# Altium project USB_HUB.PrjPcb
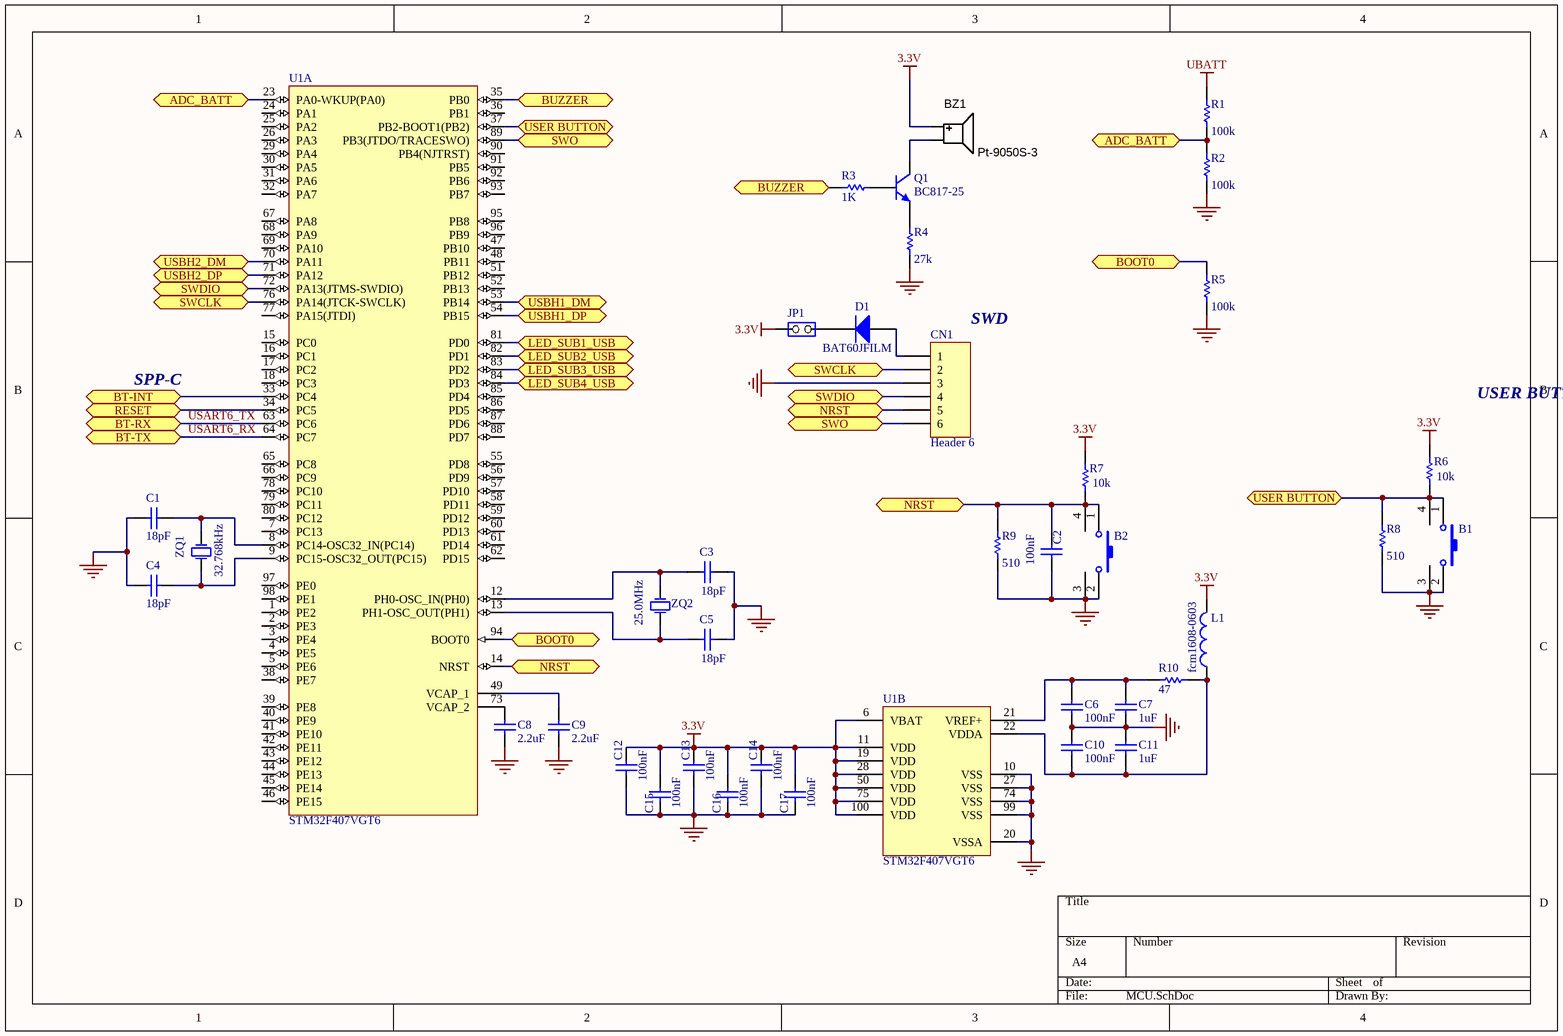
[diagram p0: MCU.SchDoc]
3 sheets, 96 parts. Net scope: flat (ports and power ports of the same name join across sheets).
Sheets:
  MCU.SchDoc
  HUB.SchDoc
  Bluetooth.SchDoc

## Sheet MCU.SchDoc
size A4

### Parts
B1  SW-PB  [SPST-2]  (value not drawn)
B2  SW-PB  [SPST-2]  (value not drawn)
BZ1  Pt-9050S-3  [BUZZER_12.0X8.5MM]
C1  value 18pF  [RAD-0.3]  (hidden comment: Cap)
C2  value 100nF  [RAD-0.3]  (hidden comment: Cap)
C3  value 18pF  [RAD-0.3]  (hidden comment: Cap)
C4  value 18pF  [RAD-0.3]  (hidden comment: Cap)
C5  value 18pF  [RAD-0.3]  (hidden comment: Cap)
C6  value 100nF  [RAD-0.3]  (hidden comment: Cap)
C7  value 1uF  [RAD-0.3]  (hidden comment: Cap)
C8  value 2.2uF  [RAD-0.3]  (hidden comment: Cap)
C9  value 2.2uF  [RAD-0.3]  (hidden comment: Cap)
C10  value 100nF  [RAD-0.3]  (hidden comment: Cap)
C11  value 1uF  [RAD-0.3]  (hidden comment: Cap)
C12  value 100nF  [RAD-0.3]  (hidden comment: Cap)
C13  value 100nF  [RAD-0.3]  (hidden comment: Cap)
C14  value 100nF  [RAD-0.3]  (hidden comment: Cap)
C15  value 100nF  [RAD-0.3]  (hidden comment: Cap)
C16  value 100nF  [RAD-0.3]  (hidden comment: Cap)
C17  value 100nF  [RAD-0.3]  (hidden comment: Cap)
CN1  Header 6  [HDR1X6]
D1  BAT60JFILM  [SOD323/A]
JP1  (no value)  [SIP2/2.54]
L1  value fcm1608-0603  [0402-A]  (hidden comment: Inductor)
Q1  BC817-25  [TO-226-AA]
R1  value 100k  [AXIAL-0.3]  (hidden comment: Res1)
R2  value 100k  [AXIAL-0.3]  (hidden comment: Res1)
R3  value 1K  [AXIAL-0.3]  (hidden comment: Res1)
R4  value 27k  [AXIAL-0.3]  (hidden comment: Res1)
R5  value 100k  [AXIAL-0.3]  (hidden comment: Res1)
R6  value 10k  [AXIAL-0.3]  (hidden comment: Res1)
R7  value 10k  [AXIAL-0.3]  (hidden comment: Res1)
R8  value 510  [AXIAL-0.3]  (hidden comment: Res1)
R9  value 510  [AXIAL-0.3]  (hidden comment: Res1)
R10  value 47  [AXIAL-0.3]  (hidden comment: Res1)
U1  STM32F407VGT6  [STM-LQFP100_N]  (parts A,B of 2)
ZQ1  value 32.768kHz  [R38]  (hidden comment: XTAL)
ZQ2  value 25.0MHz  [R38]  (hidden comment: XTAL)

### Ports
ADC_BATT (bidir), BOOT0 (bidir), BT-INT (bidir), BT-RX (bidir), BT-TX (bidir), BUZZER (bidir), LED_SUB1_USB (bidir), LED_SUB2_USB (bidir), LED_SUB3_USB (bidir), LED_SUB4_USB (bidir), NRST (bidir), RESET (bidir), SWCLK (bidir), SWDIO (bidir), SWO (bidir), USBH1_DM (bidir), USBH1_DP (bidir), USBH2_DM (bidir), USBH2_DP (bidir), USER BUTTON (bidir)

### Nets
3.3V: BZ1.1(Positive) C12.1 C13.1 C14.1 C15.1 C16.1 C17.1 JP1.2(NO) L1.2 R6.2 R7.2 U1.6(VBAT) U1.11(VDD) U1.19(VDD) U1.28(VDD) U1.50(VDD) U1.75(VDD) U1.100(VDD)
GND: B1.2 B1.3 B2.2 B2.3 C1.2 C2.1 C3.2 C4.2 C5.2 C6.1 C7.1 C8.2 C9.2 C10.2 C11.2 C12.2 C13.2 C14.2 C15.2 C16.2 C17.2 CN1.3 R2.1 R4.1 R5.1 R8.1 R9.1 U1.10(VSS) U1.20(VSSA) U1.27(VSS) U1.74(VSS) U1.99(VSS)
UBATT: R1.2
USART6_RX: U1.64(PC7) ; port BT-TX
USART6_TX: U1.63(PC6) ; port BT-RX
NetB1_1: B1.1 B1.4 R6.1 R8.2 U1.37(PB2-BOOT1(PB2)) ; port USER BUTTON
NetB2_1: B2.1 B2.4 C2.2 CN1.5 R7.1 R9.2 U1.14(NRST) ; port NRST
NetBZ1_2: BZ1.2(Negative) Q1.1(C)
NetC1_1: C1.1 U1.8(PC14-OSC32_IN(PC14)) ZQ1.2(OSC2)
NetC3_1: C3.1 U1.12(PH0-OSC_IN(PH0)) ZQ2.1(OSC1)
NetC4_1: C4.1 U1.9(PC15-OSC32_OUT(PC15)) ZQ1.1(OSC1)
NetC5_1: C5.1 U1.13(PH1-OSC_OUT(PH1)) ZQ2.2(OSC2)
NetC6_2: C6.2 C7.2 R10.2 U1.21(VREF+)
NetC8_1: C8.1 U1.73(VCAP_2)
NetC9_1: C9.1 U1.49(VCAP_1)
NetC10_1: C10.1 C11.1 L1.1 R10.1 U1.22(VDDA)
NetCN1_1: CN1.1 D1.1(A)
NetCN1_2: CN1.2 U1.76(PA14(JTCK-SWCLK)) ; port SWCLK
NetCN1_4: CN1.4 U1.72(PA13(JTMS-SWDIO)) ; port SWDIO
NetCN1_6: CN1.6 U1.89(PB3(JTDO/TRACESWO)) ; port SWO
NetCN6_2: U1.70(PA11) ; port USBH2_DM
NetCN6_3: U1.71(PA12) ; port USBH2_DP
NetD1_2: D1.2(K) JP1.1(COMMON)
NetQ1_2: Q1.2(B) R3.1
NetQ1_3: Q1.3(E) R4.2
NetR1_1: R1.1 R2.2 U1.23(PA0-WKUP(PA0)) ; port ADC_BATT
NetR3_2: R3.2 U1.35(PB0) ; port BUZZER
NetR5_2: R5.2 U1.94(BOOT0) ; port BOOT0
NetR11_2: U1.81(PD0) ; port LED_SUB1_USB
NetR12_2: U1.82(PD1) ; port LED_SUB2_USB
NetR13_2: U1.83(PD2) ; port LED_SUB3_USB
NetR14_2: U1.84(PD3) ; port LED_SUB4_USB
NetR15_1: U1.54(PB15) ; port USBH1_DP
NetR16_1: U1.53(PB14) ; port USBH1_DM
NetU1_33: U1.33(PC4) ; port BT-INT
NetU1_34: U1.34(PC5) ; port RESET

Not connected (* = marked no-connect by the designer): U1 1(PE2) 2(PE3) 3(PE4) 4(PE5) 5(PE6) 7(PC13) 15(PC0) 16(PC1) 17(PC2) 18(PC3) 24(PA1) 25(PA2) 26(PA3) 29(PA4) 30(PA5) 31(PA6) 32(PA7) 36(PB1) 38(PE7) 39(PE8) 40(PE9) 41(PE10) 42(PE11) 43(PE12) 44(PE13) 45(PE14) 46(PE15) 47(PB10) 48(PB11) 51(PB12) 52(PB13) 55(PD8) 56(PD9) 57(PD10) 58(PD11) 59(PD12) 60(PD13) 61(PD14) 62(PD15) 65(PC8) 66(PC9) 67(PA8) 68(PA9) 69(PA10) 77(PA15(JTDI)) 78(PC10) 79(PC11) 80(PC12) 85(PD4) 86(PD5) 87(PD6) 88(PD7) 90(PB4(NJTRST)) 91(PB5) 92(PB6) 93(PB7) 95(PB8) 96(PB9) 97(PE0) 98(PE1)

### Notes on the sheet
- SPP-C
- (near CN1) SWD
- USER BUTTON AND BOOT1

### Library data of the parts
B1 B2 = SW-PB: Switch; Published: 24-Mar-1999; LatestRevisionDate: 17-Jul-2002; LatestRevisionNote: Re-released for DXP Platform.; PackageReference: SPST-2; Publisher: Altium Limited; PackageDescription: Switch; 2 Leads
BZ1 = BZ_12x8.5x6.5_2kHz: Speaker, Magnetic Transducer; Manufacturer 1: CUI Inc; Manufacturer Part Number 1: CEM-1201(50); Ratings: 2048 ±200 Hz; SCDType: source; Package / Case: 6.5mm pitch; Material: Noryl SE1-J; Supplier 1: Digi-Key; Supplier Part Number 1: 102-1152-ND
C1-C17 = Cap: Capacitor; Published: 8-Jun-2000; LatestRevisionDate: 17-Jul-2002; LatestRevisionNote: Re-released for DXP Platform.; PackageReference: RAD-0.3; Publisher: Altium Limited; PackageDescription: Radial Cap, Thru-Hole; 2 Leads; 0.3 in Pin Spacing
CN1 = Header 6: Header, 6-Pin; LatestRevisionDate: 17-Jul-2002; LatestRevisionNote: Re-released for DXP Platform.; Publisher: Altium Limited
D1 = BAT60JFILM: Manuf_1: STM; Code - JEDEC: DO-214-AB; Provided: ST; Published: 8-Jun-2000; Revision: July-2002: Re-released for DXP Platform.; Publisher: Altium Limited; Order: BAT60JFILM; Manuf_Part_1: BAT60JFILM
JP1 = JP2
L1 = Inductor: Code_IEC: 1005; Published: 8-Jun-2000; LatestRevisionDate: 29-May-2009; LatestRevisionNote: IPC-7351 Footprint Added.; PackageReference: 0402-A; Publisher: Altium Limited; PackageDescription: Chip Inductor; Code_JEITA: 0402
Q1 = NPN: NPN Bipolar Transistor; Published: 8-Jun-2000; LatestRevisionDate: 17-Jul-2002; LatestRevisionNote: Re-released for DXP Platform.; PackageReference: TO-226-AA; Publisher: Altium Limited; PackageDescription: TO, Flat Index; 3 In-Line, Axial Leads; Body Dia. 4.8mm; Leads 0.55 x 0.51 mm (max); Code_JEDEC: TO-226-AA
R1-R10 = Res1: Resistor; Published: 8-Jun-2000; LatestRevisionDate: 17-Jul-2002; LatestRevisionNote: Re-released for DXP Platform.; PackageReference: AXIAL-0.3; Publisher: Altium Limited; PackageDescription: Axial Device, Thru-Hole; 2 Leads; 0.3 in Pin Spacing
U1 = STM32F407VGT6: ARM Cortex-M4 32-bit MCU+FPU, 210 DMIPS, 1024 kB Flash, 192 kB Internal RAM, 82 I/Os, 100-pin LQFP, -40 to 85 degC, Tray; Manufacturer: STMicroelectronics; D/A Converter: 2x12-bit; FLASH Size (Prog) (kB): 1024; I/Os (High Current): 82; Internal RAM Size (kB): 192; Operating Frequency(F) (Processor speed) (MHz): 168; Supply Voltage(Vcc) max (V): 3.6; Supply Voltage(Vcc) min (V): 1.8; DatasheetVersion: Rev. 4; PackageVersion: Rev. 1, 06/2013; PackageReference: LQFP100; PackageDescription: 100-Pin Low Profile Quad Flat Package, 14 x 14 mm Body, 0.5 mm Pitch; Supplier 1: Digi-Key; Supplier Part Number 1: 497-11605-ND; Supplier 2: Farnell; Supplier Part Number 2: 2064368; Supplier 3: Newark; Supplier Part Number 3: 73T2333; Supplier 4: Mouser; Supplier Part Number 4: 511-STM32F407VGT6; Core: ARM Cortex-M4; Packing: Tray; Mounting Technology: Surface Mount; PartNumber: STM32F407VGT6; ComponentLink1Description: Manufacturer URL; ComponentLink1URL: http://www.st.com/web/en/home.html; ComponentLink2Description: Datasheet; ComponentLink2URL: http://www.st.com/st-web-ui/static/active/en/resource/technical/document/datasheet/DM00037051.pdf; ComponentLink3Description: Package Specification; ComponentLink3URL: http://www.st.com/st-web-ui/static/active/en/resource/technical/document/data_brief/DM00071938.pdf
ZQ1 ZQ2 = XTAL: Crystal Oscillator; Published: 8-Jun-2000; LatestRevisionDate: 17-Jul-2002; LatestRevisionNote: Re-released for DXP Platform.; PackageReference: R38; Publisher: Altium Limited; PackageDescription: Crystal, Thru-Hole; 2 Leads; Body 3.1 x 8.2 mm (Dia.xH)

## Sheet HUB.SchDoc
size A4
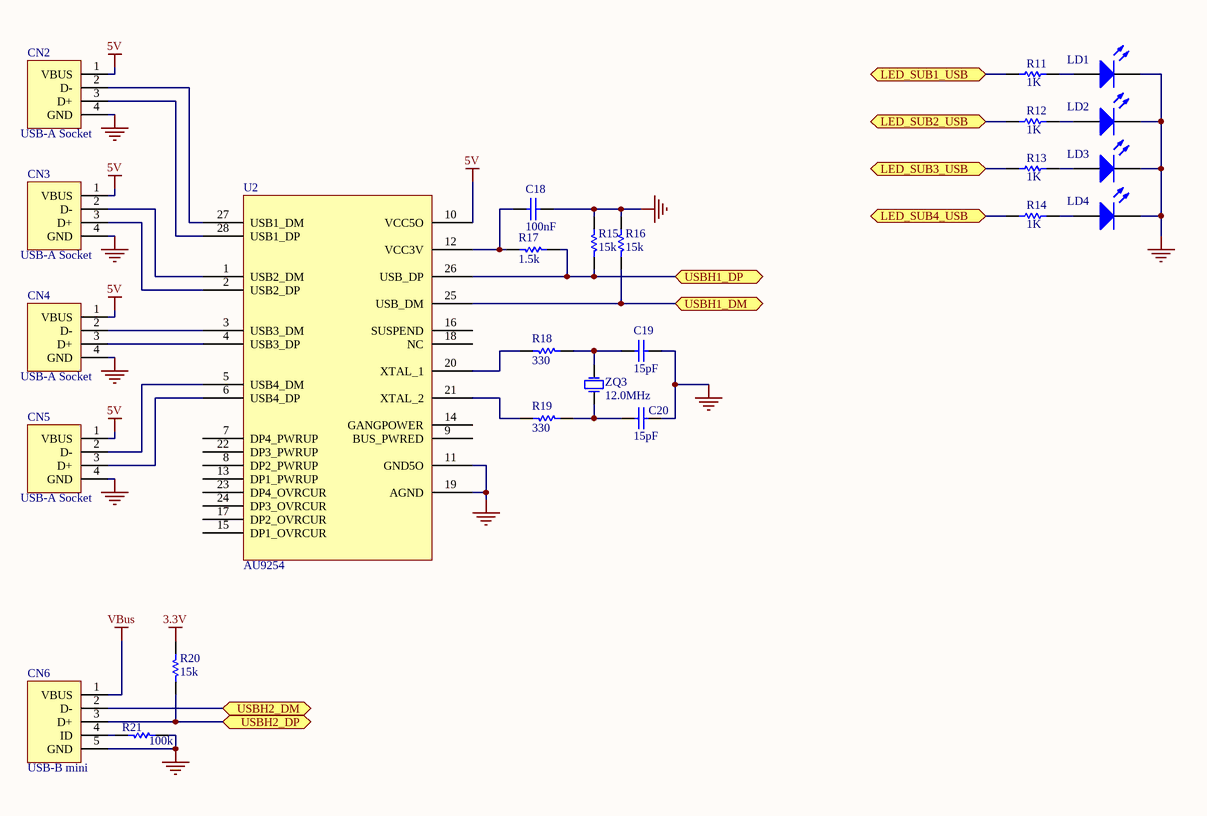
[diagram p1: HUB.SchDoc]

### Parts
C18  value 100nF  [RAD-0.3]  (hidden comment: Cap)
C19  value 15pF  [RAD-0.3]  (hidden comment: Cap)
C20  value 15pF  [RAD-0.3]  (hidden comment: Cap)
CN2  USB-A Socket  [1470695]
CN3  USB-A Socket  [1470695]
CN4  USB-A Socket  [1470695]
CN5  USB-A Socket  [1470695]
CN6  USB-B mini  [USB_micro-B]
LD1  LED1  [LED-1]  (value not drawn)
LD2  LED1  [LED-1]  (value not drawn)
LD3  LED1  [LED-1]  (value not drawn)
LD4  LED1  [LED-1]  (value not drawn)
R11  value 1K  [AXIAL-0.3]  (hidden comment: Res1)
R12  value 1K  [AXIAL-0.3]  (hidden comment: Res1)
R13  value 1K  [AXIAL-0.3]  (hidden comment: Res1)
R14  value 1K  [AXIAL-0.3]  (hidden comment: Res1)
R15  value 15k  [AXIAL-0.3]  (hidden comment: Res1)
R16  value 15k  [AXIAL-0.3]  (hidden comment: Res1)
R17  value 1.5k  [AXIAL-0.3]  (hidden comment: Res1)
R18  value 330  [AXIAL-0.3]  (hidden comment: Res1)
R19  value 330  [AXIAL-0.3]  (hidden comment: Res1)
R20  value 15k  [AXIAL-0.3]  (hidden comment: Res1)
R21  value 100k  [AXIAL-0.3]  (hidden comment: Res1)
U2  AU9254
ZQ3  value 12.0MHz  [R38]  (hidden comment: XTAL)

### Ports
LED_SUB1_USB (bidir), LED_SUB2_USB (bidir), LED_SUB3_USB (bidir), LED_SUB4_USB (bidir), USBH1_DM (bidir), USBH1_DP (bidir), USBH2_DM (bidir), USBH2_DP (bidir)

### Nets
3.3V: R20.2
5V: CN2.1(VBUS) CN3.1(VBUS) CN4.1(VBUS) CN5.1(VBUS) U2.10(VCC5O)
GND: C18.2 C19.2 C20.2 CN2.4(GND) CN3.4(GND) CN4.4(GND) CN5.4(GND) CN6.5(GND) LD1.2(K) LD2.2(K) LD3.2(K) LD4.2(K) R15.2 R16.2 R21.2 U2.11(GND5O) U2.19(AGND)
VBus: CN6.1(VBUS)
NetC18_1: C18.1 R17.1 U2.12(VCC3V)
NetC19_1: C19.1 R18.2 ZQ3.2(OSC2)
NetC20_1: C20.1 R19.2 ZQ3.1(OSC1)
NetCN2_2: CN2.2(D-) U2.27(USB1_DM)
NetCN2_3: CN2.3(D+) U2.28(USB1_DP)
NetCN3_2: CN3.2(D-) U2.1(USB2_DM)
NetCN3_3: CN3.3(D+) U2.2(USB2_DP)
NetCN4_2: CN4.2(D-) U2.3(USB3_DM)
NetCN4_3: CN4.3(D+) U2.4(USB3_DP)
NetCN5_2: CN5.2(D-) U2.5(USB4_DM)
NetCN5_3: CN5.3(D+) U2.6(USB4_DP)
NetCN6_2: CN6.2(D-) ; port USBH2_DM
NetCN6_3: CN6.3(D+) R20.1 ; port USBH2_DP
NetCN6_4: CN6.4(ID) R21.1
NetLD1_1: LD1.1(A) R11.1
NetLD2_1: LD2.1(A) R12.1
NetLD3_1: LD3.1(A) R13.1
NetLD4_1: LD4.1(A) R14.1
NetR11_2: R11.2 ; port LED_SUB1_USB
NetR12_2: R12.2 ; port LED_SUB2_USB
NetR13_2: R13.2 ; port LED_SUB3_USB
NetR14_2: R14.2 ; port LED_SUB4_USB
NetR15_1: R15.1 R17.2 U2.26(USB_DP) ; port USBH1_DP
NetR16_1: R16.1 U2.25(USB_DM) ; port USBH1_DM
NetR18_1: R18.1 U2.20(XTAL_1)
NetR19_1: R19.1 U2.21(XTAL_2)

Not connected (* = marked no-connect by the designer): U2 7(DP4_PWRUP) 8(DP2_PWRUP) 9(BUS_PWRED) 13(DP1_PWRUP) 14(GANGPOWER) 15(DP1_OVRCUR) 16(SUSPEND) 17(DP2_OVRCUR) 18(NC) 22(DP3_PWRUP) 23(DP4_OVRCUR) 24(DP3_OVRCUR)

### Library data of the parts
C18-C20 = Cap: Capacitor; Published: 8-Jun-2000; LatestRevisionDate: 17-Jul-2002; LatestRevisionNote: Re-released for DXP Platform.; PackageReference: RAD-0.3; Publisher: Altium Limited; PackageDescription: Radial Cap, Thru-Hole; 2 Leads; 0.3 in Pin Spacing
CN2-CN5 = USB-A: USB 1.1, Right Angle, SMT, A Type, Plug, 4 Position, Black; ContactMaterial: Brass; ContactPlating: Gold (30) over Nickel (50); PCB_Layout: Complies with manufacturer's recommendation.; DrillSize: Corresponds to nominal value.; PanelGround: Without; Published: 15-Jul-2004; DatasheetDocument: 21-Jan-2003; PackageDocument: 21-Jan-2003; PackageReference: 1470695; Publisher: Altium Limited; HousingMaterial: Thermoplastic; ComponentLink1Description: Manufacturer Link; ComponentLink1URL: http://www.tycoelectronics.com/; ComponentLink2Description: Packaging Specification; ComponentLink2URL: http://ecommas.tycoelectronics.com/commerce/DocumentDelivery/DDEController?Action=showdoc&DocId=Customer+Drawing%7F1470695%7FO%7Fpdf%7FEnglish%7FC_1470695_O.pdf
LD1-LD4 = LED1: Typical RED GaAs LED; Published: 8-Jun-2000; LatestRevisionDate: 08-Jul-2005; LatestRevisionNote: Mech Layer 1 removed.; PackageReference: LED-1; Publisher: Altium Limited; PackageDescription: LED; 2 Leads
R11-R21 = Res1: Resistor; Published: 8-Jun-2000; LatestRevisionDate: 17-Jul-2002; LatestRevisionNote: Re-released for DXP Platform.; PackageReference: AXIAL-0.3; Publisher: Altium Limited; PackageDescription: Axial Device, Thru-Hole; 2 Leads; 0.3 in Pin Spacing
ZQ3 = XTAL: Crystal Oscillator; Published: 8-Jun-2000; LatestRevisionDate: 17-Jul-2002; LatestRevisionNote: Re-released for DXP Platform.; PackageReference: R38; Publisher: Altium Limited; PackageDescription: Crystal, Thru-Hole; 2 Leads; Body 3.1 x 8.2 mm (Dia.xH)

## Sheet Bluetooth.SchDoc
size A4
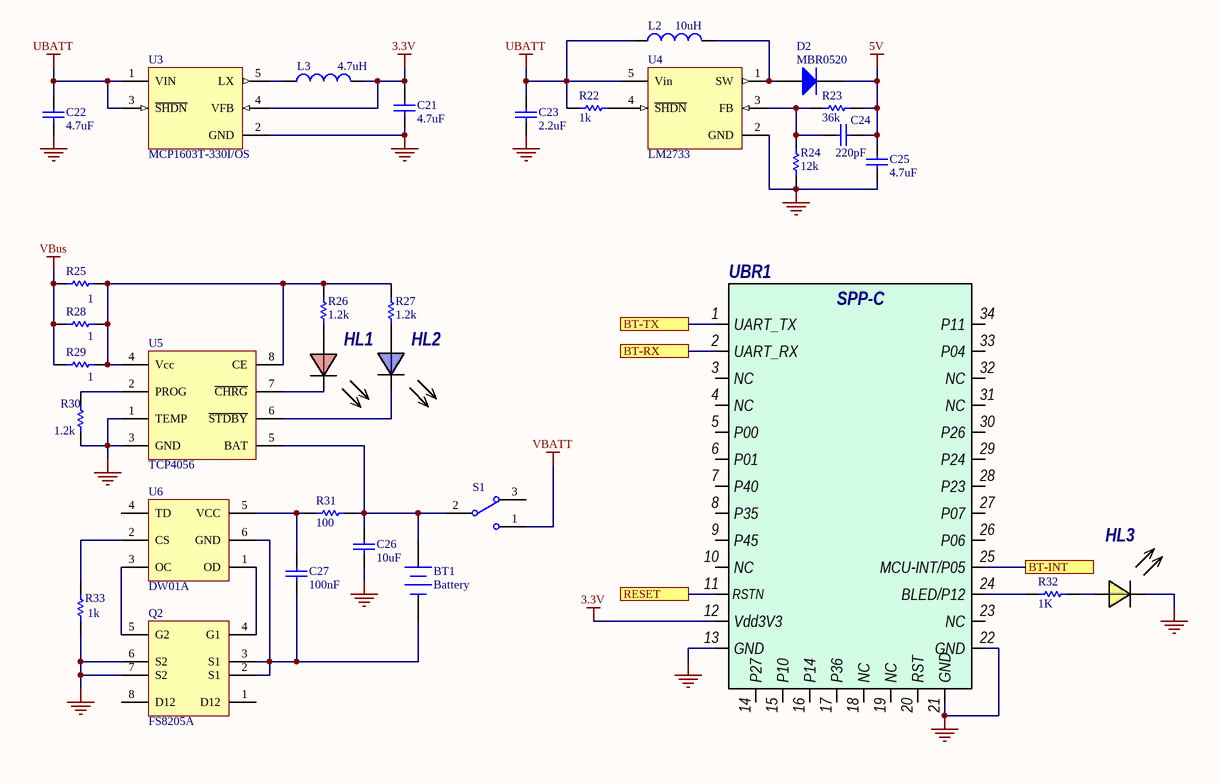
[diagram p2: Bluetooth.SchDoc]

### Parts
BT1  Battery  [BAT-2]
C21  value 4.7uF  [RAD-0.3]  (hidden comment: Cap)
C22  value 4.7uF  [RAD-0.3]  (hidden comment: Cap)
C23  value 2.2uF  [RAD-0.3]  (hidden comment: Cap)
C24  value 220pF  [RAD-0.3]  (hidden comment: Cap)
C25  value 4.7uF  [RAD-0.3]  (hidden comment: Cap)
C26  value 10uF  [RAD-0.3]  (hidden comment: Cap)
C27  value 100nF  [RAD-0.3]  (hidden comment: Cap)
D2  MBR0520  [SOD323/A]
HL1  LED_Red  [0603_Red]  (value not drawn)
HL2  LED_Blue  [0603_Blue]  (value not drawn)
HL3  Yellow  [0603_Yellow]  (value not drawn)
L2  value 10uH  [0402-A]  (hidden comment: Inductor)
L3  value 4.7uH  [0402-A]  (hidden comment: Inductor)
Q2  FS8205A  [TSSOP8]
R22  value 1k  [AXIAL-0.3]  (hidden comment: Res1)
R23  value 36k  [AXIAL-0.3]  (hidden comment: Res1)
R24  value 12k  [AXIAL-0.3]  (hidden comment: Res1)
R25  value 1  [AXIAL-0.3]  (hidden comment: Res1)
R26  value 1.2k  [AXIAL-0.3]  (hidden comment: Res1)
R27  value 1.2k  [AXIAL-0.3]  (hidden comment: Res1)
R28  value 1  [AXIAL-0.3]  (hidden comment: Res1)
R29  value 1  [AXIAL-0.3]  (hidden comment: Res1)
R30  value 1.2k  [AXIAL-0.3]  (hidden comment: Res1)
R31  value 100  [AXIAL-0.3]  (hidden comment: Res1)
R32  value 1K  [AXIAL-0.3]  (hidden comment: Res1)
R33  value 1k  [AXIAL-0.3]  (hidden comment: Res1)
S1  SW-SPDT  [TL36WW15050]  (value not drawn)
U3  MCP1603T-330I/OS  [SOT23_5]
U4  LM2733  [SOT23_5]
U5  TCP4056  [SO8]
U6  DW01A  [SOT23_6]
UBR1  SPP-C  [SPP-C]  (value not drawn)

### Ports
BT-INT, BT-RX, BT-TX, RESET

### Nets
3.3V: C21.2 L3.2 U3.4(VFB) UBR1.12(Vdd3V3)
5V: C24.1 C25.2 D2.2(K) R23.1
GND: C21.1 C22.1 C23.1 C25.1 C26.1 HL3.C Q2.6(S2) Q2.7(S2) R24.2 R30.1 R33.1 U3.2(GND) U4.2(GND) U5.1(TEMP) U5.3(GND) UBR1.13(GND) UBR1.21(GND) UBR1.22(GND)
UBATT: C22.2 C23.2 L2.1 R22.2 U3.1(VIN) U3.3(~{SHDN}) U4.5(Vin)
VBATT: S1.1
VBus: R25.2 R28.2 R29.2
USART6_RX: UBR1.1(UART_TX) ; port BT-TX
USART6_TX: UBR1.2(UART_RX) ; port BT-RX
NetBT1_1: BT1.1(+) C26.2 R31.1 S1.2 U5.5(BAT)
NetBT1_2: BT1.2(-) C27.1 Q2.2(S1) Q2.3(S1) U6.6(GND)
NetC24_2: C24.2 R23.2 R24.1 U4.3(FB)
NetC27_2: C27.2 R31.2 U6.5(VCC)
NetD2_1: D2.1(A) L2.2 U4.1(SW)
NetHL1_A: HL1.A R26.1
NetHL1_C: HL1.C U5.7(~{CHRG})
NetHL2_A: HL2.A R27.1
NetHL2_C: HL2.C U5.6(~{STDBY})
NetHL3_A: HL3.A R32.1
NetL3_1: L3.1 U3.5(LX)
NetQ2_4: Q2.4(G1) U6.1(OD)
NetQ2_5: Q2.5(G2) U6.3(OC)
NetR22_1: R22.1 U4.4(~{SHDN})
NetR25_1: R25.1 R26.2 R27.2 R28.1 R29.1 U5.4(Vcc) U5.8(CE)
NetR30_2: R30.2 U5.2(PROG)
NetR32_2: R32.2 UBR1.24(BLED/P12)
NetR33_2: R33.2 U6.2(CS)
NetU1_33: UBR1.25(MCU-INT/P05) ; port BT-INT
NetU1_34: UBR1.11(RSTN) ; port RESET

Not connected (* = marked no-connect by the designer): Q2 1(D12) 8(D12); S1 3; U6 4(TD); UBR1 3(NC) 4(NC) 5(P00) 6(P01) 7(P40) 8(P35) 9(P45) 10(NC) 14(P27) 15(P10) 16(P14) 17(P36) 18(NC) 19(NC) 20(RST) 23(NC) 26(P06) 27(P07) 28(P23) 29(P24) 30(P26) 31(NC) 32(NC) 33(P04) 34(P11)

### Library data of the parts
BT1 = Battery: Multicell Battery; Published: 24-Mar-1999; LatestRevisionDate: 17-Jul-2002; LatestRevisionNote: Re-released for DXP Platform.; PackageReference: BAT-2; Publisher: Altium Limited; PackageDescription: Battery; 2 Leads
C21-C27 = Cap: Capacitor; Published: 8-Jun-2000; LatestRevisionDate: 17-Jul-2002; LatestRevisionNote: Re-released for DXP Platform.; PackageReference: RAD-0.3; Publisher: Altium Limited; PackageDescription: Radial Cap, Thru-Hole; 2 Leads; 0.3 in Pin Spacing
D2 = BAT60JFILM: as D1 on sheet MCU; Published: 8-Jun-2000; Revision: July-2002: Re-released for DXP Platform.; Publisher: Altium Limited; Order: BAT60JFILM; Manuf_Part_1: BAT60JFILM
HL1 = LED_Red: LED Red
HL2 = LED_Blue: LED Blue
HL3 = LED_Yellow: LED Yellow
L2 L3 = Inductor: Code_IEC: 1005; Published: 8-Jun-2000; LatestRevisionDate: 29-May-2009; LatestRevisionNote: IPC-7351 Footprint Added.; PackageReference: 0402-A; Publisher: Altium Limited; PackageDescription: Chip Inductor; Code_JEITA: 0402
R22-R33 = Res1: Resistor; Published: 8-Jun-2000; LatestRevisionDate: 17-Jul-2002; LatestRevisionNote: Re-released for DXP Platform.; PackageReference: AXIAL-0.3; Publisher: Altium Limited; PackageDescription: Axial Device, Thru-Hole; 2 Leads; 0.3 in Pin Spacing
S1 = SW-SPDT: SPDT Subminiature Toggle Switch, Right Angle Mounting, Vertical Actuation; Published: 24-Mar-1999; LatestRevisionDate: 17-Dec-2003; LatestRevisionNote: Schematic revised, PCB Footprint replaced.; DatasheetVersion: 05-Dec-2000; PackageReference: TL36WW15050; Publisher: Altium Limited; PackageDescription: Switch; 4 Leads; ComponentLink1Description: Manufacturer Link; ComponentLink1URL: http://www.apem.com
U3 = MCP1603T-330I/OS: 500mA Synchronous Buck Regulator, 3.3V, 2.0 MHz, 5-Pin TSOT, Industrial Temperature, Tape and Reel; Published: 29-Jan-2009; DatasheetVersion: revA, May-2007; PackageVersion: revBB, Aug-2009; PackageReference: TSOT-OS5; Publisher: Altium Limited; PackageDescription: 5-Lead Plastic Small Outline Transistor (OS) [TSOT]; Supplier 1: Digi-Key; Supplier Part Number 1: MCP1603T-330I/OSTR-ND; Supplier 2: Digi-Key; Supplier Part Number 2: MCP1603T-330I/OSCT-ND; Supplier 3: Digi-Key; Supplier Part Number 3: MCP1603T-330I/OSDKR-ND; Supplier 4: Farnell; Supplier Part Number 4: 1439373; ComponentLink1Description: Datasheet; ComponentLink1URL: http://ww1.microchip.com/downloads/en/DeviceDoc/22042a.pdf; ComponentLink2Description: Packaging Specification; ComponentLink2URL: http://www.microchip.com/stellent/groups/techpub_sg/documents/packagingspec/en012702.pdf
U4 = LM2733: 0.6/1.6 MHz Boost Converters With 40V Internal FET Switch; Published: 29-Jan-2009; DatasheetVersion: revA, May-2007; PackageVersion: revBB, Aug-2009; PackageReference: TSOT-OS5; Publisher: Altium Limited; PackageDescription: 5-Lead Plastic Small Outline Transistor (OS) [TSOT]; Supplier Part Number 1: MCP1603T-330I/OSTR-ND; Supplier 2: Digi-Key; Supplier Part Number 2: MCP1603T-330I/OSCT-ND; Supplier 3: Digi-Key; Supplier Part Number 3: MCP1603T-330I/OSDKR-ND; Supplier 4: Farnell; Supplier Part Number 4: 1439373; ComponentLink1Description: Datasheet; ComponentLink1URL: http://ww1.microchip.com/downloads/en/DeviceDoc/22042a.pdf; ComponentLink2Description: Packaging Specification; ComponentLink2URL: http://www.microchip.com/stellent/groups/techpub_sg/documents/packagingspec/en012702.pdf
U5 = TP4056
UBR1 = SPP-C: Bluetooth Module

## Nets that join several sheets
3.3V: MCU (18 pins), HUB (R20.2), Bluetooth (C21.2 L3.2 U3.4 UBR1.12)
5V: HUB (5 pins), Bluetooth (C24.1 C25.2 D2.2 R23.1)
GND: MCU (32 pins), HUB (17 pins), Bluetooth (18 pins)
UBATT: MCU (R1.2), Bluetooth (7 pins)
VBus: HUB (CN6.1), Bluetooth (R25.2 R28.2 R29.2)
NetCN6_2: MCU (U1.70), HUB (CN6.2)
NetCN6_3: MCU (U1.71), HUB (CN6.3 R20.1)
NetR11_2: MCU (U1.81), HUB (R11.2)
NetR12_2: MCU (U1.82), HUB (R12.2)
NetR13_2: MCU (U1.83), HUB (R13.2)
NetR14_2: MCU (U1.84), HUB (R14.2)
NetR15_1: MCU (U1.54), HUB (R15.1 R17.2 U2.26)
NetR16_1: MCU (U1.53), HUB (R16.1 U2.25)
NetU1_33: MCU (U1.33), Bluetooth (UBR1.25)
NetU1_34: MCU (U1.34), Bluetooth (UBR1.11)
USART6_RX: MCU (U1.64), Bluetooth (UBR1.1)
USART6_TX: MCU (U1.63), Bluetooth (UBR1.2)